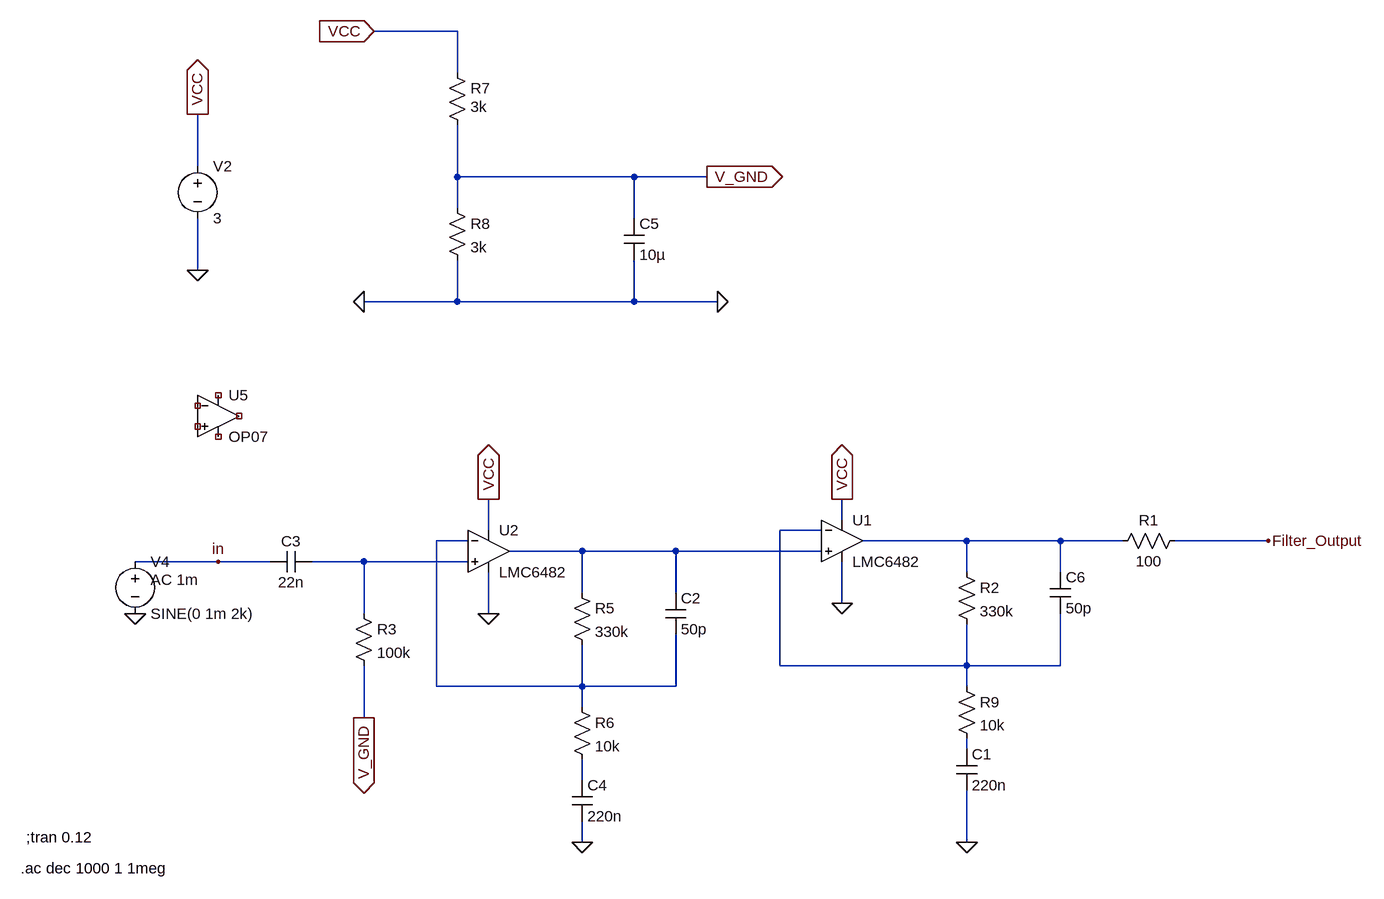
[diagram p0: schematic Filter_Circuit_PM4.asc]
Filter_Circuit_PM4.asc, the LTspice schematic file:
Version 4
SHEET 1 3036 680
WIRE 544 -1312 416 -1312
WIRE 544 -1248 544 -1312
WIRE 144 -1104 144 -1184
WIRE 544 -1088 544 -1168
WIRE 816 -1088 544 -1088
WIRE 928 -1088 816 -1088
WIRE 544 -1040 544 -1088
WIRE 816 -1024 816 -1088
WIRE 144 -944 144 -1024
WIRE 544 -896 544 -960
WIRE 544 -896 400 -896
WIRE 816 -896 816 -960
WIRE 816 -896 544 -896
WIRE 944 -896 816 -896
WIRE 1136 -560 1136 -592
WIRE 592 -544 592 -592
WIRE 1104 -544 1040 -544
WIRE 560 -528 512 -528
WIRE 1328 -528 1168 -528
WIRE 1472 -528 1328 -528
WIRE 1568 -528 1472 -528
WIRE 1792 -528 1648 -528
WIRE 736 -512 624 -512
WIRE 880 -512 736 -512
WIRE 1104 -512 880 -512
WIRE 176 -496 48 -496
WIRE 256 -496 176 -496
WIRE 400 -496 320 -496
WIRE 560 -496 400 -496
WIRE 1328 -480 1328 -528
WIRE 1472 -480 1472 -528
WIRE 736 -448 736 -512
WIRE 880 -448 880 -512
WIRE 1136 -432 1136 -496
WIRE 400 -416 400 -496
WIRE 592 -416 592 -480
WIRE 1040 -336 1040 -544
WIRE 1328 -336 1328 -400
WIRE 1328 -336 1040 -336
WIRE 1472 -336 1472 -416
WIRE 1472 -336 1328 -336
WIRE 512 -304 512 -528
WIRE 736 -304 736 -368
WIRE 736 -304 512 -304
WIRE 880 -304 880 -384
WIRE 880 -304 736 -304
WIRE 1328 -304 1328 -336
WIRE 736 -272 736 -304
WIRE 400 -256 400 -336
WIRE 1328 -208 1328 -224
WIRE 736 -160 736 -192
WIRE 736 -64 736 -96
WIRE 1328 -64 1328 -144
FLAG 144 -944 0
FLAG 736 -64 0
FLAG 592 -416 0
FLAG 144 -1184 VCC
IOPIN 144 -1184 Out
FLAG 1136 -592 VCC
IOPIN 1136 -592 Out
FLAG 48 -416 0
FLAG 592 -592 VCC
IOPIN 592 -592 Out
FLAG 944 -896 0
FLAG 400 -896 0
FLAG 928 -1088 V_GND
IOPIN 928 -1088 Out
FLAG 416 -1312 VCC
IOPIN 416 -1312 In
FLAG 1328 -64 0
FLAG 1792 -528 Filter_Output
FLAG 1136 -432 0
FLAG 400 -256 V_GND
IOPIN 400 -256 Out
FLAG 176 -496 in
SYMBOL voltage 144 -1120 R0
SYMATTR InstName V2
SYMATTR Value 3
SYMBOL cap 320 -512 R90
WINDOW 0 0 32 VBottom 2
WINDOW 3 32 32 VTop 2
SYMATTR InstName C3
SYMATTR Value 22n
SYMBOL res 720 -464 R0
SYMATTR InstName R5
SYMATTR Value 330k
SYMBOL res 720 -288 R0
SYMATTR InstName R6
SYMATTR Value 10k
SYMBOL cap 720 -160 R0
SYMATTR InstName C4
SYMATTR Value 220n
SYMBOL voltage 48 -512 R0
WINDOW 123 24 44 Left 2
WINDOW 39 0 0 Left 2
SYMATTR Value2 AC 1m
SYMATTR InstName V4
SYMATTR Value SINE(0 1m 2k)
SYMBOL res 528 -1264 R0
WINDOW 3 36 68 Left 2
SYMATTR Value 3k
SYMATTR InstName R7
SYMBOL res 528 -1056 R0
SYMATTR InstName R8
SYMATTR Value 3k
SYMBOL cap 800 -1024 R0
SYMATTR InstName C5
SYMATTR Value 10µ
SYMBOL res 1312 -496 R0
SYMATTR InstName R2
SYMATTR Value 330k
SYMBOL res 1312 -320 R0
SYMATTR InstName R9
SYMATTR Value 10k
SYMBOL cap 1312 -208 R0
SYMATTR InstName C1
SYMATTR Value 220n
SYMBOL cap 864 -448 R0
SYMATTR InstName C2
SYMATTR Value 50p
SYMBOL cap 1456 -480 R0
SYMATTR InstName C6
SYMATTR Value 50p
SYMBOL res 1664 -544 R90
WINDOW 0 0 56 VBottom 2
WINDOW 3 32 56 VTop 2
SYMATTR InstName R1
SYMATTR Value 100
SYMBOL res 384 -432 R0
SYMATTR InstName R3
SYMATTR Value 100k
SYMBOL Opamps\\OP07 176 -784 R0
SYMATTR InstName U5
SYMBOL ZHAW\\LMC6482 1136 -592 R0
SYMATTR InstName U1
SYMBOL ZHAW\\LMC6482 592 -576 R0
SYMATTR InstName U2
TEXT -120 -72 Left 2 !;tran 0.12
TEXT -128 -24 Left 2 !.ac dec 1000 1 1meg

The netlist it stands for:
* Filter_Circuit_PM4.asc
V2 VCC 0 3
C3 N005 in 22n
R5 N004 N002 330k
R6 N002 N007 10k
C4 N007 0 220n
V4 in 0 SINE(0 1m 2k) AC 1m
R7 VCC V_GND 3k
R8 V_GND 0 3k
C5 V_GND 0 10µ
R2 N003 N001 330k
R9 N001 N006 10k
C1 N006 0 220n
C2 N004 N002 50p
C6 N003 N001 50p
R1 Filter_Output N003 100
R3 N005 V_GND 100k
XU5 NC_01 NC_02 NC_03 NC_04 NC_05 LT1001  ; OP07, pins In+ In- V+ V- OUT
* U1: LMC6482 (symbol ZHAW\LMC6482 not available, pins judged from their places): In+=N004 In-=N001 V+=VCC V-=0 OUT=N003
* U2: LMC6482 (symbol ZHAW\LMC6482 not available, pins judged from their places): In+=N005 In-=N002 V+=VCC V-=0 OUT=N004
;tran 0.12
.ac dec 1000 1 1meg
.lib LTC.lib
.backanno
.end